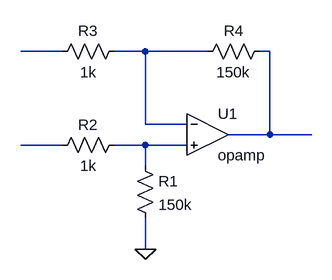
[diagram p0: schematic Draft3.asc]
Draft3.asc, the LTspice schematic file:
Version 4
SHEET 1 880 680
WIRE 144 208 80 208
WIRE 272 208 224 208
WIRE 368 208 272 208
WIRE 464 208 448 208
WIRE 272 320 272 208
WIRE 336 320 272 320
WIRE 464 336 464 208
WIRE 464 336 400 336
WIRE 528 336 464 336
WIRE 144 352 80 352
WIRE 272 352 224 352
WIRE 336 352 272 352
WIRE 272 384 272 352
WIRE 272 512 272 464
FLAG 272 512 0
SYMBOL Opamps/opamp 368 272 R0
SYMATTR InstName U1
SYMBOL res 256 368 R0
SYMATTR InstName R1
SYMATTR Value 150k
SYMBOL res 240 336 R90
WINDOW 0 0 56 VBottom 2
WINDOW 3 32 56 VTop 2
SYMATTR InstName R2
SYMATTR Value 1k
SYMBOL res 240 192 R90
WINDOW 0 0 56 VBottom 2
WINDOW 3 32 56 VTop 2
SYMATTR InstName R3
SYMATTR Value 1k
SYMBOL res 464 192 R90
WINDOW 0 0 56 VBottom 2
WINDOW 3 32 56 VTop 2
SYMATTR InstName R4
SYMATTR Value 150k

The netlist it stands for:
* Draft3.asc
XU1 N002 N005 N003 opamp Aol=100K GBW=10Meg  ; pins invin noninvin out
R1 N005 0 150k
R2 N005 N004 1k
R3 N002 N001 1k
R4 N003 N002 150k
.backanno
.end